# Altium schematic sheet АЧАД.524656.003_Э3.SchDoc: Наименование
size 209 x 297 mm; ApprovedBy: Утвердил; CheckedBy: Проверил; Author: Разработал; CompanyName: ТОВ "Радіонікс"; DrawnBy: Н.Контр; Engineer: Т.Контр; SheetNumber: 1; SheetTotal: 1; PageSetup: Record=PageOptions|CenterHorizontal=True|CenterVertical=True|PrintScale=0.99|XCorrection=1.00|YCorrection=1.00|PrintKind=1|BorderSize=5000000|LeftOffset=0|BottomOffset=0|Orientation=1|PaperLength=1000|PaperWidth=1000|Scale=100|PaperSource=7|PrintQuality=-4|MediaType=1|DitherType=10|PrintScaleMode=1|PaperKind=A4; DecimalNumber: АЧАД.524656.003 Э3; HeadOfSector: Нач. сектора; MainDevice: Перв.примен.; Name: Датчик кута; DecimalNumber_MIRROR: 300.656425.ДАЧА; DocumentName: Sheet1.SCHDOC
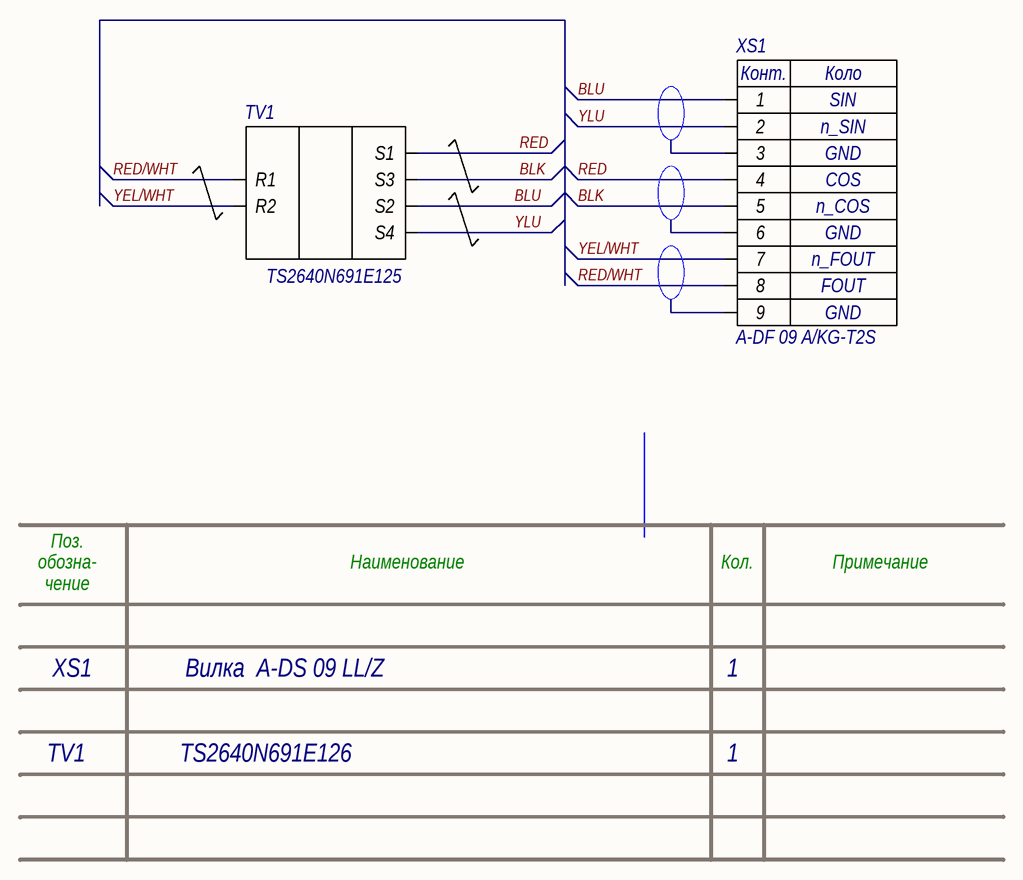
[diagram p0: АЧАД.524656.003_Э3.SchDoc]

## Parts
TV1  ENGLE_SENSOR  (value not drawn)
XS1  A-DF 09 A/KG-T2S

## Nets
BLK: TV1.4(S3) XS1.5
BLU: TV1.5(S2) XS1.1
RED: TV1.3(S1) XS1.4
RED/WHT: TV1.1(R1) XS1.8
YEL/WHT: TV1.2(R2) XS1.7
YLU: TV1.6(S4) XS1.2

Not connected (* = marked no-connect by the designer): XS1 3 6 9

## Notes on the sheet
- SIN
- n_SIN
- COS
- n_COS
- GND
- n_FOUT
- (near TV1) TS2640N691E125
- FOUT
- Поз.
- обозна-
- чение
- Наименование
- Кол.
- Примечание
- XS1
- Вилка  A-DS 09 LL/Z
- 1
- TV1
- TS2640N691E126
- Перв.примен.
- Справ.№
- Подп. и дата
- Инв.№ дубл.
- Взам.инв.№
- Подп.и дата
- Разраб.
- Изм.
- Лист
- № докум.
- Подп.
- Дата
- Лит.
- Масштаб
- Масса
- Т.контр.
- Пров.
- СХЕМА   ЕЛЕКТРИЧНА
- ПРИНЦИПОВА
- Листов
- Инв.№ подл.
- Утв.
- Н.контр.
- Нач.сект.
- Копировал
- Формат  A4
- (in symbol A-DF 09 A/KG-T2S) Конт.; Коло